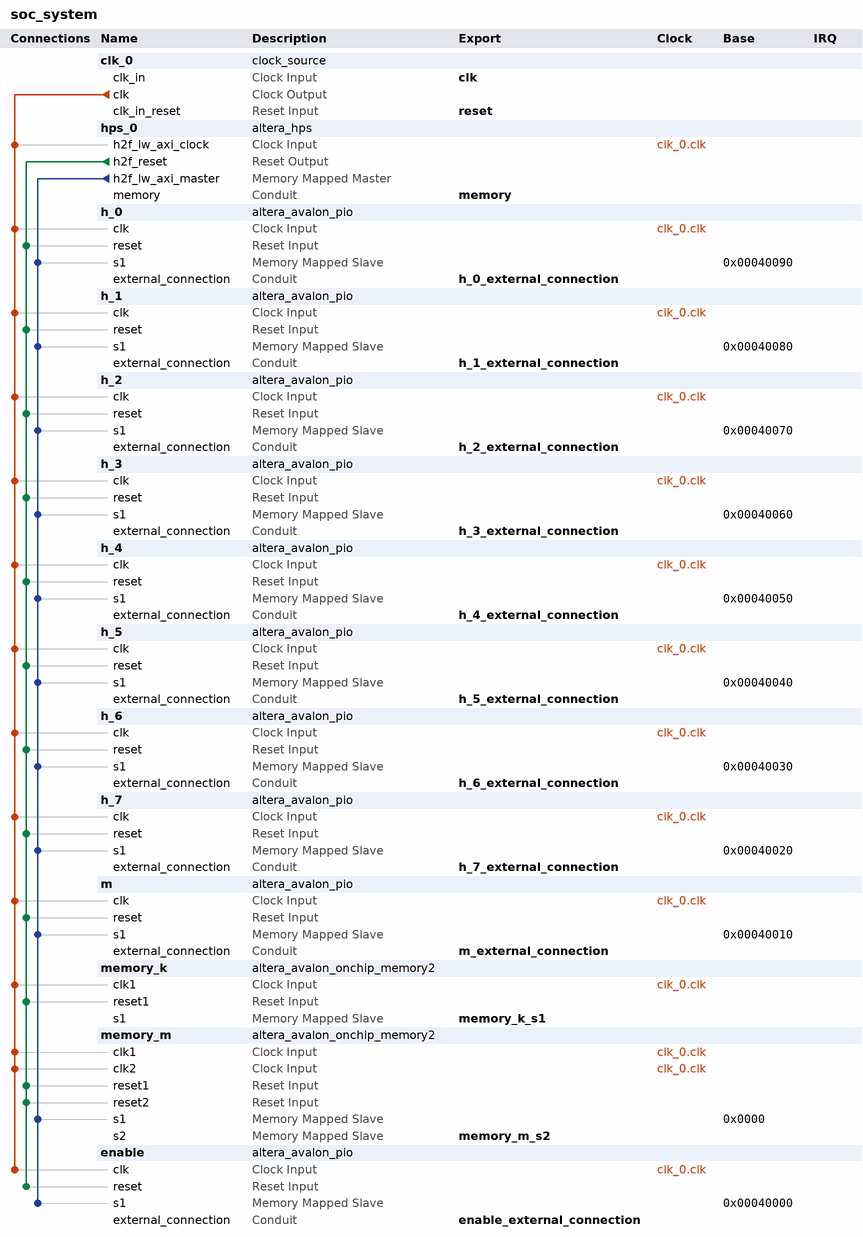
[diagram p0: system contents]
# Platform Designer (Qsys) system soc_system, Cyclone V 5CSEMA5F31C6
# Parameters at their usual value, and those the tool derives, are not listed.
package require -exact qsys 18.0
create_system soc_system
set_project_property DEVICE_FAMILY {Cyclone V}
set_project_property DEVICE 5CSEMA5F31C6

add_instance clk_0 clock_source 18.0
set_instance_parameter_value clk_0 clockFrequency 50000000

add_instance hps_0 altera_hps 18.0
set_instance_parameter_value hps_0 EMAC1_Mode N/A
set_instance_parameter_value hps_0 EMAC1_PinMuxing Unused
set_instance_parameter_value hps_0 F2SCLK_COLDRST_Enable false
set_instance_parameter_value hps_0 F2SCLK_DBGRST_Enable false
set_instance_parameter_value hps_0 F2SCLK_WARMRST_Enable false
set_instance_parameter_value hps_0 F2SINTERRUPT_Enable true
set_instance_parameter_value hps_0 F2S_Width 0
set_instance_parameter_value hps_0 FPGA_PERIPHERAL_OUTPUT_CLOCK_FREQ_EMAC0_GTX_CLK 125
set_instance_parameter_value hps_0 FPGA_PERIPHERAL_OUTPUT_CLOCK_FREQ_EMAC0_MD_CLK 2.5
set_instance_parameter_value hps_0 FPGA_PERIPHERAL_OUTPUT_CLOCK_FREQ_EMAC1_GTX_CLK 125
set_instance_parameter_value hps_0 FPGA_PERIPHERAL_OUTPUT_CLOCK_FREQ_EMAC1_MD_CLK 2.5
set_instance_parameter_value hps_0 HPS_PROTOCOL DDR3
set_instance_parameter_value hps_0 I2C0_Mode N/A
set_instance_parameter_value hps_0 I2C0_PinMuxing Unused
set_instance_parameter_value hps_0 I2C1_Mode N/A
set_instance_parameter_value hps_0 I2C1_PinMuxing Unused
set_instance_parameter_value hps_0 LWH2F_Enable true
set_instance_parameter_value hps_0 MEM_BANKADDR_WIDTH 3
set_instance_parameter_value hps_0 MEM_CLK_FREQ 300.0
set_instance_parameter_value hps_0 MEM_CLK_FREQ_MAX 400.0
set_instance_parameter_value hps_0 MEM_COL_ADDR_WIDTH 8
set_instance_parameter_value hps_0 MEM_DQ_WIDTH 8
set_instance_parameter_value hps_0 MEM_DRV_STR RZQ/6
set_instance_parameter_value hps_0 MEM_ROW_ADDR_WIDTH 12
set_instance_parameter_value hps_0 MEM_RTT_NOM RZQ/6
set_instance_parameter_value hps_0 MEM_RTT_WR {Dynamic ODT off}
set_instance_parameter_value hps_0 MEM_TCL 7
set_instance_parameter_value hps_0 MEM_TFAW_NS 37.5
set_instance_parameter_value hps_0 MEM_TINIT_US 499
set_instance_parameter_value hps_0 MEM_TMRD_CK 3
set_instance_parameter_value hps_0 MEM_TRAS_NS 40.0
set_instance_parameter_value hps_0 MEM_TRCD_NS 15.0
set_instance_parameter_value hps_0 MEM_TREFI_US 7.0
set_instance_parameter_value hps_0 MEM_TRFC_NS 75.0
set_instance_parameter_value hps_0 MEM_TRP_NS 15.0
set_instance_parameter_value hps_0 MEM_TWTR 2
set_instance_parameter_value hps_0 MEM_VENDOR JEDEC
set_instance_parameter_value hps_0 MEM_WTCL 6
set_instance_parameter_value hps_0 QSPI_Mode N/A
set_instance_parameter_value hps_0 QSPI_PinMuxing Unused
set_instance_parameter_value hps_0 REF_CLK_FREQ 125.0
set_instance_parameter_value hps_0 S2FCLK_USER2CLK 5
set_instance_parameter_value hps_0 S2F_Width 0
set_instance_parameter_value hps_0 SDIO_Mode N/A
set_instance_parameter_value hps_0 SDIO_PinMuxing Unused
set_instance_parameter_value hps_0 SPIM1_Mode N/A
set_instance_parameter_value hps_0 SPIM1_PinMuxing Unused
set_instance_parameter_value hps_0 STM_Enable false
set_instance_parameter_value hps_0 TIMING_BOARD_AC_SKEW 0.02
set_instance_parameter_value hps_0 TIMING_BOARD_AC_TO_CK_SKEW 0.0
set_instance_parameter_value hps_0 TIMING_BOARD_DQ_TO_DQS_SKEW 0.0
set_instance_parameter_value hps_0 TIMING_BOARD_MAX_CK_DELAY 0.6
set_instance_parameter_value hps_0 TIMING_BOARD_MAX_DQS_DELAY 0.6
set_instance_parameter_value hps_0 TIMING_BOARD_SKEW_BETWEEN_DQS 0.02
set_instance_parameter_value hps_0 TIMING_BOARD_SKEW_CKDQS_DIMM_MAX 0.01
set_instance_parameter_value hps_0 TIMING_BOARD_SKEW_CKDQS_DIMM_MIN -0.01
set_instance_parameter_value hps_0 TIMING_BOARD_SKEW_WITHIN_DQS 0.02
set_instance_parameter_value hps_0 TIMING_TDH 125
set_instance_parameter_value hps_0 TIMING_TDQSCK 400
set_instance_parameter_value hps_0 TIMING_TDQSQ 120
set_instance_parameter_value hps_0 TIMING_TDS 50
set_instance_parameter_value hps_0 TIMING_TIH 250
set_instance_parameter_value hps_0 TIMING_TIS 175
set_instance_parameter_value hps_0 TIMING_TQSH 0.38
set_instance_parameter_value hps_0 UART0_Mode N/A
set_instance_parameter_value hps_0 UART0_PinMuxing Unused
set_instance_parameter_value hps_0 USB1_Mode N/A
set_instance_parameter_value hps_0 USB1_PinMuxing Unused
set_instance_parameter_value hps_0 desired_cfg_clk_mhz 100.0
set_instance_parameter_value hps_0 desired_qspi_clk_mhz 400.0

add_instance h_0 altera_avalon_pio 18.0
set_instance_parameter_value h_0 direction Input
set_instance_parameter_value h_0 width 32

add_instance h_1 altera_avalon_pio 18.0
set_instance_parameter_value h_1 direction Input
set_instance_parameter_value h_1 width 32

add_instance h_2 altera_avalon_pio 18.0
set_instance_parameter_value h_2 direction Input
set_instance_parameter_value h_2 width 32

add_instance h_3 altera_avalon_pio 18.0
set_instance_parameter_value h_3 direction Input
set_instance_parameter_value h_3 width 32

add_instance h_4 altera_avalon_pio 18.0
set_instance_parameter_value h_4 direction Input
set_instance_parameter_value h_4 width 32

add_instance h_5 altera_avalon_pio 18.0
set_instance_parameter_value h_5 direction Input
set_instance_parameter_value h_5 width 32

add_instance h_6 altera_avalon_pio 18.0
set_instance_parameter_value h_6 direction Input
set_instance_parameter_value h_6 width 32

add_instance h_7 altera_avalon_pio 18.0
set_instance_parameter_value h_7 direction Input
set_instance_parameter_value h_7 width 32

add_instance m altera_avalon_pio 18.0
set_instance_parameter_value m direction Output
set_instance_parameter_value m width 8

add_instance memory_k altera_avalon_onchip_memory2 18.0
set_instance_parameter_value memory_k dataWidth 32
set_instance_parameter_value memory_k dualPort false
set_instance_parameter_value memory_k initMemContent true
set_instance_parameter_value memory_k initializationFileName C:/Users/sa/Desktop/foo.hex
set_instance_parameter_value memory_k memorySize 2048
set_instance_parameter_value memory_k useNonDefaultInitFile true
set_instance_parameter_value memory_k writable false

add_instance memory_m altera_avalon_onchip_memory2 18.0
set_instance_parameter_value memory_m dataWidth 32
set_instance_parameter_value memory_m dualPort true
set_instance_parameter_value memory_m initMemContent true
set_instance_parameter_value memory_m initializationFileName onchip_mem.hex
set_instance_parameter_value memory_m memorySize 262144

add_instance enable altera_avalon_pio 18.0
set_instance_parameter_value enable direction Output
set_instance_parameter_value enable width 1

# connections
add_connection clk_0.clk enable.clk clock
add_connection clk_0.clk h_0.clk clock
add_connection clk_0.clk h_1.clk clock
add_connection clk_0.clk h_2.clk clock
add_connection clk_0.clk h_3.clk clock
add_connection clk_0.clk h_4.clk clock
add_connection clk_0.clk h_5.clk clock
add_connection clk_0.clk h_6.clk clock
add_connection clk_0.clk h_7.clk clock
add_connection clk_0.clk hps_0.h2f_lw_axi_clock clock
add_connection clk_0.clk m.clk clock
add_connection clk_0.clk memory_k.clk1 clock
add_connection clk_0.clk memory_m.clk1 clock
add_connection clk_0.clk memory_m.clk2 clock
add_connection hps_0.h2f_reset enable.reset reset
add_connection hps_0.h2f_reset h_0.reset reset
add_connection hps_0.h2f_reset h_1.reset reset
add_connection hps_0.h2f_reset h_2.reset reset
add_connection hps_0.h2f_reset h_3.reset reset
add_connection hps_0.h2f_reset h_4.reset reset
add_connection hps_0.h2f_reset h_5.reset reset
add_connection hps_0.h2f_reset h_6.reset reset
add_connection hps_0.h2f_reset h_7.reset reset
add_connection hps_0.h2f_reset m.reset reset
add_connection hps_0.h2f_reset memory_k.reset1 reset
add_connection hps_0.h2f_reset memory_m.reset1 reset
add_connection hps_0.h2f_reset memory_m.reset2 reset
add_connection hps_0.h2f_lw_axi_master enable.s1 avalon
set_connection_parameter_value hps_0.h2f_lw_axi_master/enable.s1 baseAddress 0x00040000
add_connection hps_0.h2f_lw_axi_master h_0.s1 avalon
set_connection_parameter_value hps_0.h2f_lw_axi_master/h_0.s1 baseAddress 0x00040090
add_connection hps_0.h2f_lw_axi_master h_1.s1 avalon
set_connection_parameter_value hps_0.h2f_lw_axi_master/h_1.s1 baseAddress 0x00040080
add_connection hps_0.h2f_lw_axi_master h_2.s1 avalon
set_connection_parameter_value hps_0.h2f_lw_axi_master/h_2.s1 baseAddress 0x00040070
add_connection hps_0.h2f_lw_axi_master h_3.s1 avalon
set_connection_parameter_value hps_0.h2f_lw_axi_master/h_3.s1 baseAddress 0x00040060
add_connection hps_0.h2f_lw_axi_master h_4.s1 avalon
set_connection_parameter_value hps_0.h2f_lw_axi_master/h_4.s1 baseAddress 0x00040050
add_connection hps_0.h2f_lw_axi_master h_5.s1 avalon
set_connection_parameter_value hps_0.h2f_lw_axi_master/h_5.s1 baseAddress 0x00040040
add_connection hps_0.h2f_lw_axi_master h_6.s1 avalon
set_connection_parameter_value hps_0.h2f_lw_axi_master/h_6.s1 baseAddress 0x00040030
add_connection hps_0.h2f_lw_axi_master h_7.s1 avalon
set_connection_parameter_value hps_0.h2f_lw_axi_master/h_7.s1 baseAddress 0x00040020
add_connection hps_0.h2f_lw_axi_master m.s1 avalon
set_connection_parameter_value hps_0.h2f_lw_axi_master/m.s1 baseAddress 0x00040010
add_connection hps_0.h2f_lw_axi_master memory_m.s1 avalon
set_connection_parameter_value hps_0.h2f_lw_axi_master/memory_m.s1 baseAddress 0x0000

# exported interfaces
add_interface clk clock sink
set_interface_property clk EXPORT_OF clk_0.clk_in
add_interface enable_external_connection conduit end
set_interface_property enable_external_connection EXPORT_OF enable.external_connection
add_interface h_0_external_connection conduit end
set_interface_property h_0_external_connection EXPORT_OF h_0.external_connection
add_interface h_1_external_connection conduit end
set_interface_property h_1_external_connection EXPORT_OF h_1.external_connection
add_interface h_2_external_connection conduit end
set_interface_property h_2_external_connection EXPORT_OF h_2.external_connection
add_interface h_3_external_connection conduit end
set_interface_property h_3_external_connection EXPORT_OF h_3.external_connection
add_interface h_4_external_connection conduit end
set_interface_property h_4_external_connection EXPORT_OF h_4.external_connection
add_interface h_5_external_connection conduit end
set_interface_property h_5_external_connection EXPORT_OF h_5.external_connection
add_interface h_6_external_connection conduit end
set_interface_property h_6_external_connection EXPORT_OF h_6.external_connection
add_interface h_7_external_connection conduit end
set_interface_property h_7_external_connection EXPORT_OF h_7.external_connection
add_interface m_external_connection conduit end
set_interface_property m_external_connection EXPORT_OF m.external_connection
add_interface memory conduit end
set_interface_property memory EXPORT_OF hps_0.memory
add_interface memory_k_s1 avalon slave
set_interface_property memory_k_s1 EXPORT_OF memory_k.s1
add_interface memory_m_s2 avalon slave
set_interface_property memory_m_s2 EXPORT_OF memory_m.s2
add_interface reset reset sink
set_interface_property reset EXPORT_OF clk_0.clk_in_reset

set_interconnect_requirement {$system} qsys_mm.clockCrossingAdapter AUTO
set_interconnect_requirement {$system} qsys_mm.enableEccProtection FALSE
set_interconnect_requirement {$system} qsys_mm.insertDefaultSlave FALSE
set_interconnect_requirement {$system} qsys_mm.maxAdditionalLatency 1

save_system soc_system.qsys
